# Altium schematic sheet Connectors.SchDoc
size A4
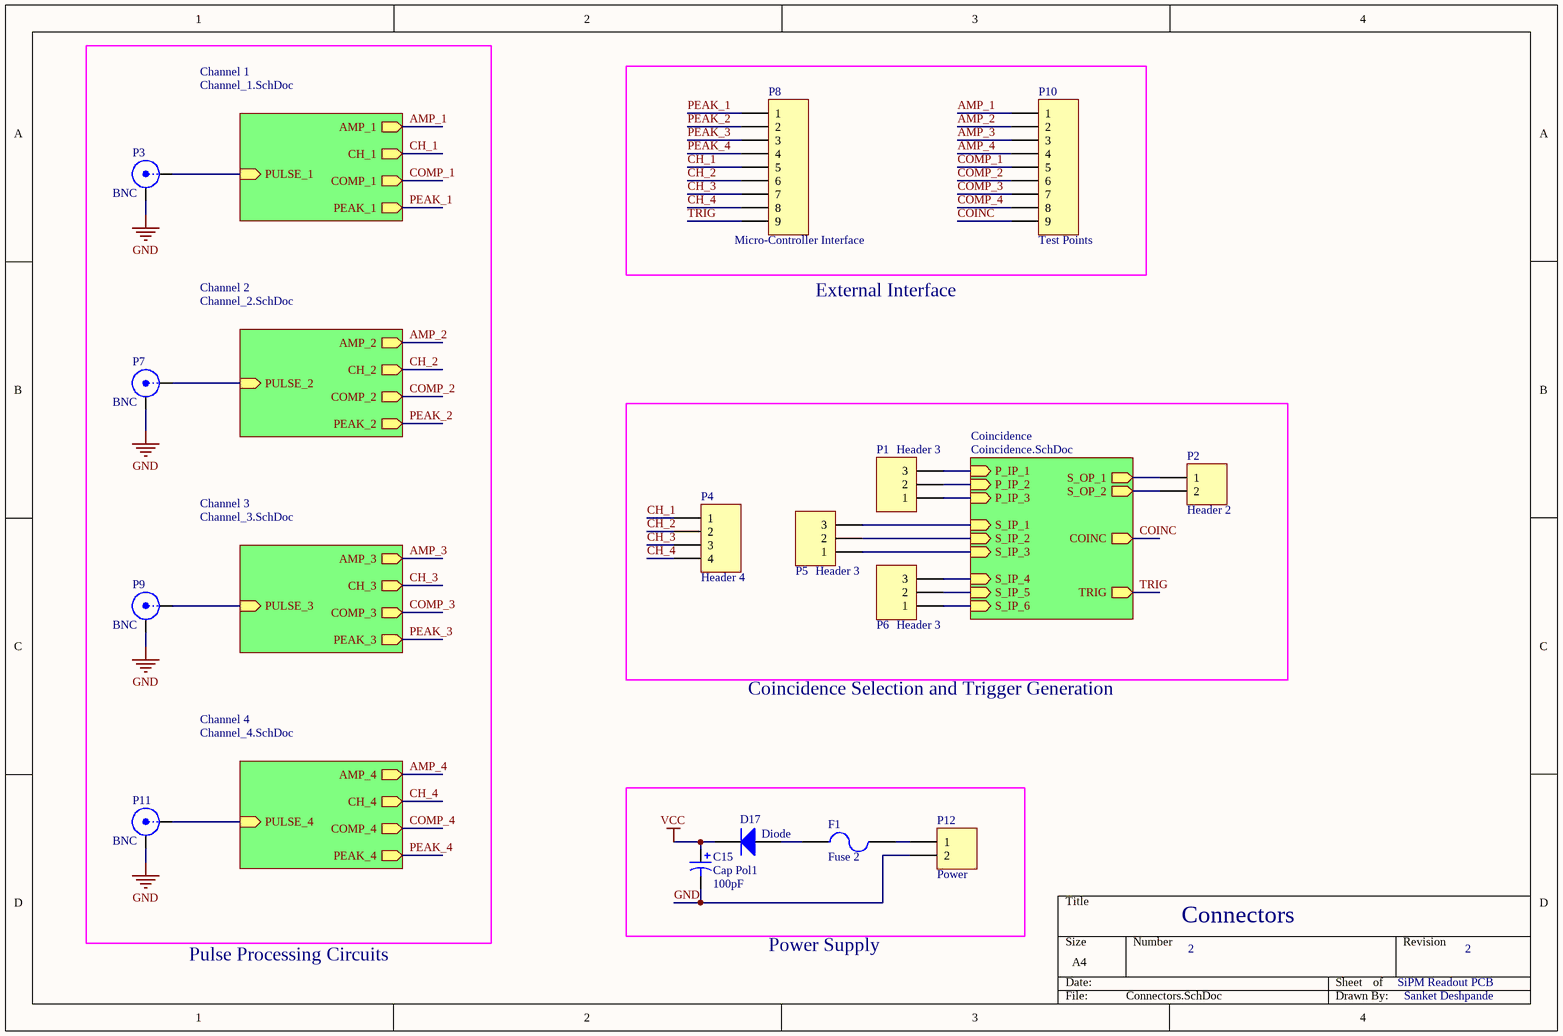
[diagram p0: Connectors.SchDoc]

## Parts
C15  Cap Pol1  value 100pF  [RB7.6-15]
D17  Diode  [SMC]
F1  Fuse 2  [PIN-W2/E2.8]
P1  Header 3  [HDR1X3]
P2  Header 2  [HDR1X2]
P3  BNC  [BNC_RA CON]
P4  Header 4  [HDR1X4]
P5  Header 3  [HDR1X3]
P6  Header 3  [HDR1X3]
P7  BNC  [BNC_RA CON]
P8  Micro-Controller Interface  [HDR1X9]
P9  BNC  [BNC_RA CON]
P10  Test Points  [HDR1X9]
P11  BNC  [BNC_RA CON]
P12  Power  [HDR1X2]

## Sub-sheets
Channel 1 = Channel_1.SchDoc: PULSE_1 (in), AMP_1 (out), CH_1 (out), PEAK_1 (out), COMP_1 (out)
Channel 2 = Channel_2.SchDoc: PULSE_2 (in), AMP_2 (out), CH_2 (out), PEAK_2 (out), COMP_2 (out)
Channel 3 = Channel_3.SchDoc: PULSE_3 (in), AMP_3 (out), CH_3 (out), PEAK_3 (out), COMP_3 (out)
Channel 4 = Channel_4.SchDoc: PULSE_4 (in), AMP_4 (out), CH_4 (out), PEAK_4 (out), COMP_4 (out)
Coincidence = Coincidence.SchDoc: P_IP_1 (in), P_IP_2 (in), P_IP_3 (in), S_IP_1 (in), S_IP_2 (in), S_IP_3 (in), S_IP_4 (in), S_IP_5 (in), S_IP_6 (in), S_OP_1 (out), S_OP_2 (out), TRIG (out), COINC (out)

## Nets
GND: C15.2 P3.2(Y) P7.2(Y) P9.2(Y) P11.2(Y) P12.2
VCC: C15.1 D17.2(K)
AMP_1: P10.1 ; sheet Channel 1/AMP_1
AMP_2: P10.2 ; sheet Channel 2/AMP_2
AMP_3: P10.3 ; sheet Channel 3/AMP_3
AMP_4: P10.4 ; sheet Channel 4/AMP_4
CH_1: P4.1 P8.5 ; sheet Channel 1/CH_1
CH_2: P4.2 P8.6 ; sheet Channel 2/CH_2
CH_3: P4.3 P8.7 ; sheet Channel 3/CH_3
CH_4: P4.4 P8.8 ; sheet Channel 4/CH_4
COINC: P10.9 ; sheet Coincidence/COINC
COMP_1: P10.5 ; sheet Channel 1/COMP_1
COMP_2: P10.6 ; sheet Channel 2/COMP_2
COMP_3: P10.7 ; sheet Channel 3/COMP_3
COMP_4: P10.8 ; sheet Channel 4/COMP_4
PEAK_1: P8.1 ; sheet Channel 1/PEAK_1
PEAK_2: P8.2 ; sheet Channel 2/PEAK_2
PEAK_3: P8.3 ; sheet Channel 3/PEAK_3
PEAK_4: P8.4 ; sheet Channel 4/PEAK_4
TRIG: P8.9 ; sheet Coincidence/TRIG
NetD17_1: D17.1(A) F1.1
NetF1_2: F1.2 P12.1
NetP1_1: P1.1 ; sheet Coincidence/P_IP_3
NetP1_2: P1.2 ; sheet Coincidence/P_IP_2
NetP1_3: P1.3 ; sheet Coincidence/P_IP_1
NetP2_1: P2.1 ; sheet Coincidence/S_OP_1
NetP2_2: P2.2 ; sheet Coincidence/S_OP_2
NetP3_1: P3.1(X) ; sheet Channel 1/PULSE_1
NetP5_1: P5.1 ; sheet Coincidence/S_IP_3
NetP5_2: P5.2 ; sheet Coincidence/S_IP_2
NetP5_3: P5.3 ; sheet Coincidence/S_IP_1
NetP6_1: P6.1 ; sheet Coincidence/S_IP_6
NetP6_2: P6.2 ; sheet Coincidence/S_IP_5
NetP6_3: P6.3 ; sheet Coincidence/S_IP_4
NetP7_1: P7.1(X) ; sheet Channel 2/PULSE_2
NetP9_1: P9.1(X) ; sheet Channel 3/PULSE_3
NetP11_1: P11.1(X) ; sheet Channel 4/PULSE_4

## Notes on the sheet
- External Interface
- Coincidence Selection and Trigger Generation
- Pulse Processing Circuits
- Power Supply
- Connectors
- 2
- SiPM Readout PCB
- Sanket Deshpande

## Library data of the parts
C15 = Cap Pol1: Polarized Capacitor (Radial); Published: 8-Jun-2000; LatestRevisionDate: 17-Jul-2002; LatestRevisionNote: Re-released for DXP Platform.; PackageReference: RB7.6-15; Publisher: Altium Limited; PackageDescription: Polarized Capacitor (Radial); 2 Leads
D17 = Diode: Default Diode; Published: 8-Jun-2000; LatestRevisionDate: 17-Jul-2002; LatestRevisionNote: Re-released for DXP Platform.; PackageVersion: Sep-1996; PackageReference: SMC; Publisher: Altium Limited; PackageDescription: DO-214-AB/SMC; 2 C-Bend Leads; Body 7.9 x 5.9 mm, inc. leads (LxW); Code_JEDEC: DO-214-AB
F1 = Fuse 2: Fuse; Published: 8-Jun-2000; LatestRevisionDate: 17-Jul-2002; LatestRevisionNote: Re-released for DXP Platform.; PackageReference: PIN-W2/E2.8; Publisher: Altium Limited; PackageDescription: Thru-Hole; 2 Leads
P1 P5 P6 = Header 3: Header, 3-Pin; LatestRevisionDate: 17-Jul-2002; LatestRevisionNote: Re-released for DXP Platform.; Publisher: Altium Limited
P2 P12 = Header 2: Header, 2-Pin; LatestRevisionDate: 17-Jul-2002; LatestRevisionNote: Re-released for DXP Platform.; Publisher: Altium Limited
P3 P7 P9 P11 = BNC: BNC Elbow Connector; LatestRevisionDate: 17-Jul-2002; LatestRevisionNote: Re-released for DXP Platform.; Publisher: Altium Limited
P4 = Header 4: Header, 4-Pin; LatestRevisionDate: 17-Jul-2002; LatestRevisionNote: Re-released for DXP Platform.; Publisher: Altium Limited
P8 P10 = Header 9: Header, 9-Pin; LatestRevisionDate: 17-Jul-2002; LatestRevisionNote: Re-released for DXP Platform.; Publisher: Altium Limited